# Altium schematic sheet SP8T_ecal_3.SchDoc
size B; SheetNumber: 3; SheetTotal: 3; SCH_REV: 2.0
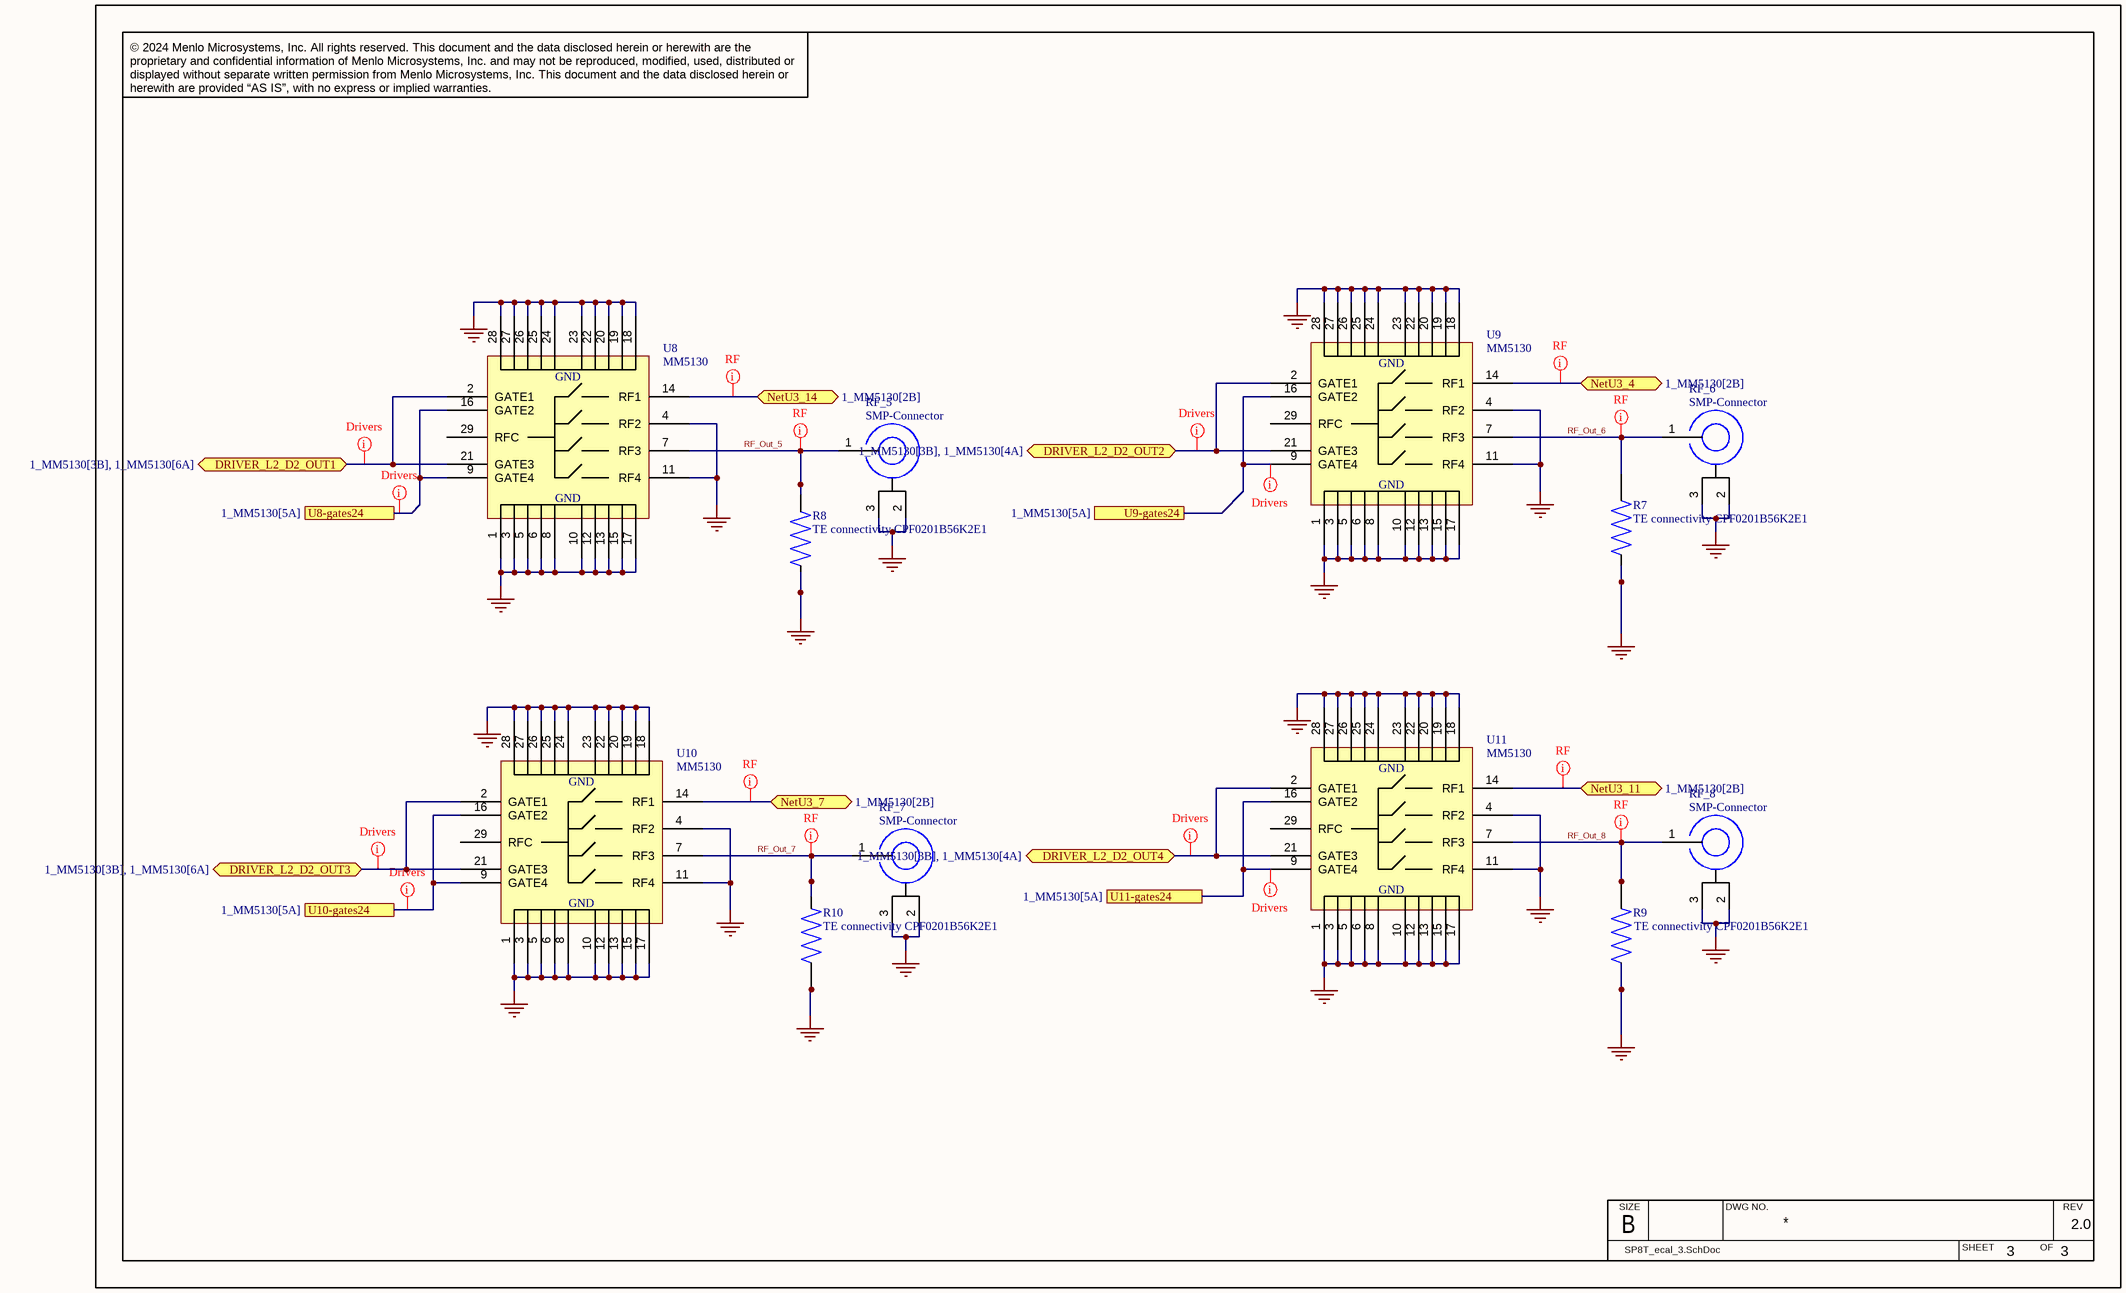
[diagram p0: SP8T_ecal_3.SchDoc]

## Parts
R7  TE connectivity CPF0201B56K2E1  [0201-resistor]
R8  TE connectivity CPF0201B56K2E1  [0201-resistor]
R9  TE connectivity CPF0201B56K2E1  [0201-resistor]
R10  TE connectivity CPF0201B56K2E1  [0201-resistor]
RF_5  Type: SMP-Connector  [CONN-PE44490]  (hidden comment: PE44490)
RF_6  Type: SMP-Connector  [CONN-PE44490]  (hidden comment: PE44490)
RF_7  Type: SMP-Connector  [CONN-PE44490]  (hidden comment: PE44490)
RF_8  Type: SMP-Connector  [CONN-PE44490]  (hidden comment: PE44490)
U8  MM5130  [MM5130-SP_M_PCB_NOFLOOD]
U9  MM5130  [MM5130-SP_M_PCB_NOFLOOD]
U10  MM5130  [MM5130-SP_M_PCB_NOFLOOD]
U11  MM5130  [MM5130-SP_M_PCB_NOFLOOD]

## Ports
DRIVER_L2_D2_OUT1 (bidir, see 1_MM5130[3B], 1_MM5130[6A]), DRIVER_L2_D2_OUT2 (bidir, see 1_MM5130[3B], 1_MM5130[4A]), DRIVER_L2_D2_OUT3 (bidir, see 1_MM5130[3B], 1_MM5130[6A]), DRIVER_L2_D2_OUT4 (bidir, see 1_MM5130[3B], 1_MM5130[4A]), NetU3_4 (bidir, see 1_MM5130[2B]), NetU3_7 (bidir, see 1_MM5130[2B]), NetU3_11 (bidir, see 1_MM5130[2B]), NetU3_14 (bidir, see 1_MM5130[2B]), U8-gates24 (see 1_MM5130[5A]), U9-gates24 (see 1_MM5130[5A]), U10-gates24 (see 1_MM5130[5A]), U11-gates24 (see 1_MM5130[5A])

## Nets
GND: R7.2 R8.2 R9.2 R10.2 RF_5.2 RF_5.3 RF_6.2 RF_6.3 RF_7.2 RF_7.3 RF_8.2 RF_8.3 U8.1(GND) U8.3(GND) U8.4(RF2) U8.5(GND) U8.6(GND) U8.8(GND) U8.10(GND) U8.11(RF4) U8.12(GND) U8.13(GND) U8.15(GND) U8.17(GND) U8.18(GND) U8.19(GND) U8.20(GND) U8.22(GND) U8.23(GND) U8.24(GND) U8.25(GND) U8.26(GND) U8.27(GND) U8.28(GND) U9.1(GND) U9.3(GND) U9.4(RF2) U9.5(GND) U9.6(GND) U9.8(GND) U9.10(GND) U9.11(RF4) U9.12(GND) U9.13(GND) U9.15(GND) U9.17(GND) U9.18(GND) U9.19(GND) U9.20(GND) U9.22(GND) U9.23(GND) U9.24(GND) U9.25(GND) U9.26(GND) U9.27(GND) U9.28(GND) U10.1(GND) U10.3(GND) U10.4(RF2) U10.5(GND) U10.6(GND) U10.8(GND) U10.10(GND) U10.11(RF4) U10.12(GND) U10.13(GND) U10.15(GND) U10.17(GND) U10.18(GND) U10.19(GND) U10.20(GND) U10.22(GND) U10.23(GND) U10.24(GND) U10.25(GND) U10.26(GND) U10.27(GND) U10.28(GND) U11.1(GND) U11.3(GND) U11.4(RF2) U11.5(GND) U11.6(GND) U11.8(GND) U11.10(GND) U11.11(RF4) U11.12(GND) U11.13(GND) U11.15(GND) U11.17(GND) U11.18(GND) U11.19(GND) U11.20(GND) U11.22(GND) U11.23(GND) U11.24(GND) U11.25(GND) U11.26(GND) U11.27(GND) U11.28(GND)
DRIVER_L2_D2_OUT1: U8.2(GATE1) U8.21(GATE3) ; port DRIVER_L2_D2_OUT1
DRIVER_L2_D2_OUT2: U9.2(GATE1) U9.21(GATE3) ; port DRIVER_L2_D2_OUT2
DRIVER_L2_D2_OUT3: U10.2(GATE1) U10.21(GATE3) ; port DRIVER_L2_D2_OUT3
DRIVER_L2_D2_OUT4: U11.2(GATE1) U11.21(GATE3) ; port DRIVER_L2_D2_OUT4
NetU3_4: U9.14(RF1) ; port NetU3_4
NetU3_7: U10.14(RF1) ; port NetU3_7
NetU3_11: U11.14(RF1) ; port NetU3_11
NetU3_14: U8.14(RF1) ; port NetU3_14
RF_Out_5: R8.1 RF_5.1 U8.7(RF3)
RF_Out_6: R7.1 RF_6.1 U9.7(RF3)
RF_Out_7: R10.1 RF_7.1 U10.7(RF3)
RF_Out_8: R9.1 RF_8.1 U11.7(RF3)
U8-gates24: U8.9(GATE4) U8.16(GATE2) ; port U8-gates24
U9-gates24: U9.9(GATE4) U9.16(GATE2) ; port U9-gates24
U10-gates24: U10.9(GATE4) U10.16(GATE2) ; port U10-gates24
U11-gates24: U11.9(GATE4) U11.16(GATE2) ; port U11-gates24

Not connected (* = marked no-connect by the designer): U8 29(RFC); U9 29(RFC); U10 29(RFC); U11 29(RFC)

## Layout directives
net class Drivers: DRIVER_L2_D2_OUT1, DRIVER_L2_D2_OUT2, DRIVER_L2_D2_OUT3, DRIVER_L2_D2_OUT4, U8-gates24, U9-gates24, U10-gates24, U11-gates24
net class RF: NetU3_4, NetU3_7, NetU3_11, NetU3_14, RF_Out_5, RF_Out_6, RF_Out_7, RF_Out_8

## Notes on the sheet
- © 2024 Menlo Microsystems, Inc. All rights reserved. This document and the data disclosed herein or herewith are the proprietary and confidential information of Menlo Microsystems, Inc. and may not be reproduced, modified, used, distributed or displayed without separate written permission from Menlo Microsystems, Inc. This document and the data disclosed herein or herewith are provided “AS IS”, with no express or implied warranties.
- SIZE
- B
- DWG NO.
- SHEET
- OF
- REV

## Library data of the parts
R7-R10 = TE connectivity CPF0201B56K2E1: CPF 0201 56K2 0.1% 25PPM 1K RL; MP: ERJ1GN0R00C; Value: 56k; Availability: Unavailable; Price: None; Package: None; Mfgr: TE connectivity; Mfgr Part No.: CPF0201B56K2E1
RF_5-RF_8 = CONN-PE44490: SMP, Mini Connector Plug, Male Pin 50 Ohms Board Edge, Cutout; Surface Mount Solder; Manufacturer: Pasternack; Manufacturer_Part_Number: PE44490
U8-U11 = IC-MM5130: High power SP4T MEMs switch